# EAGLE design dc_motor (EAGLE 7.2.0)
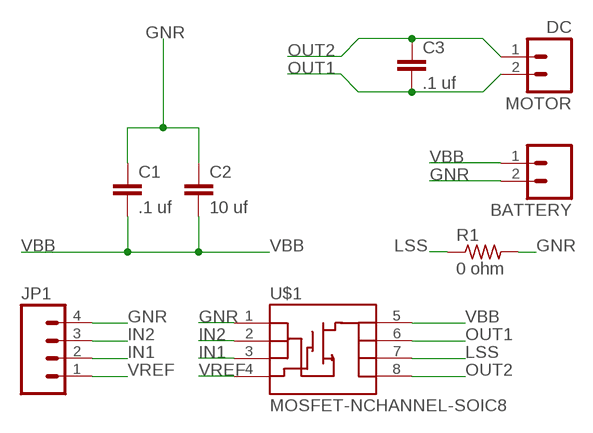
[diagram p0: schematic, sheet 1]

## Parts
BATTERY  M02  [1X02_LONGPADS]
C1  .1 uf  CAP1206  [1206]
C2  10 uf  CAP1206  [1206]
C3  .1 uf  CAP1206  [1206]
JP1  M04LONGPADS  [1X04_LONGPADS]
MOTOR  DC  M02  [1X02_LONGPADS]
R1  0 ohm  RESISTOR1206  [1206]
U$1  MOSFET-NCHANNEL-SOIC8  [SO08]

## Nets
GNR: BATTERY.2 C1.1 C2.1 JP1.4 R1.2 U$1.1(S)
IN1: JP1.2 U$1.3(S)
IN2: JP1.3 U$1.2(S)
LSS: R1.1 U$1.7(D)
OUT1: C3.2 MOTOR.2 U$1.6(D)
OUT2: C3.1 MOTOR.1 U$1.8(D)
VBB: BATTERY.1 C1.2 C2.2 U$1.5(D)
VREF: JP1.1 U$1.4(G)

## Library data of the parts
BATTERY MOTOR = 01_SparkFun:M02: Header 2 Standard 2-pin 0.1" header. Use with straight break away headers (SKU : PRT-00116), right angle break away headers (PRT-00553), swiss pins (PRT-00743), machine pins (PRT-00117), and female headers (PRT-00115). Molex polarized connector foot print use with SKU : PRT-08233 with associated crimp pins and housings.
C1-C3 = 01_SparkFun:CAP: Capacitor Standard 0603 ceramic capacitor, and 0.1" leaded capacitor.
JP1 = 01_SparkFun:M04: Header 4 Standard 4-pin 0.1" header. Use with straight break away headers (SKU : PRT-00116), right angle break away headers (PRT-00553), swiss pins (PRT-00743), machine pins (PRT-00117), and female headers (PRT-00115). Molex polarized connector foot print use with SKU : PRT-08231 with associated crimp pins and housings.
R1 = 01_FAB_Hello:RESISTOR
U$1 = 01_SparkFun:MOSFET-NCHANNEL-SOIC8: N-Channel MOSFET IRF9410 and NDS8434 are common, SOIC-8 parts.

## Board
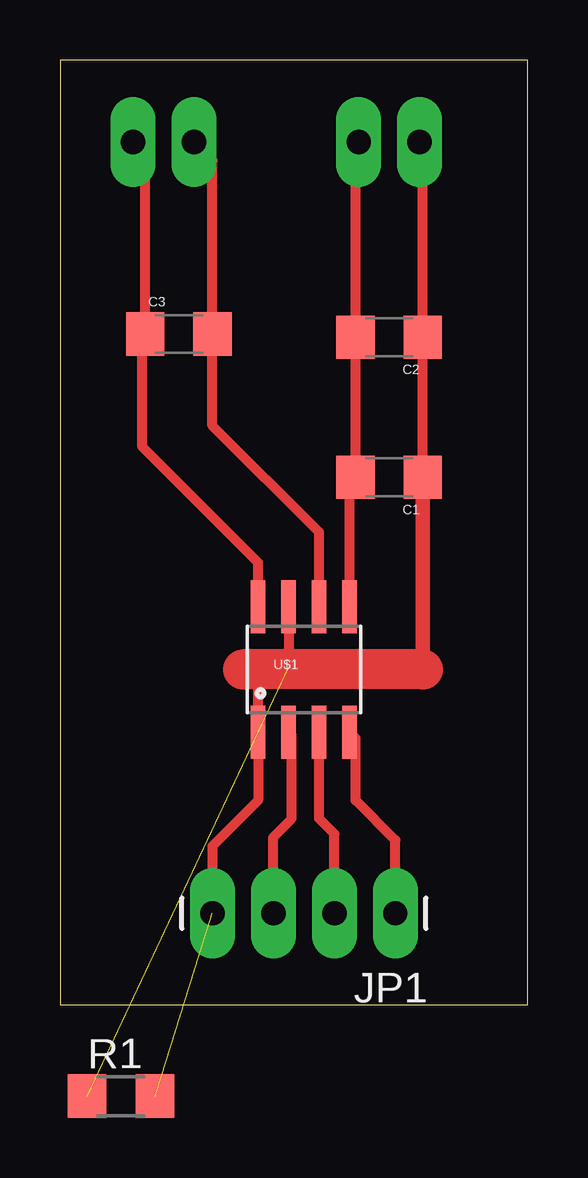
[diagram p1: board, top side]

Size 19.48 x 39.36 mm. Coordinates in mm from the lower left corner, seen from the top.
Outline: 0,0 19.48,0 19.48,39.36 0,39.36 0,0
Copper layers (1*16): Top 0.035mm / dielectric 1.5mm / Bottom 0.035mm
Design rules "default": minimum track width 10mil, minimum drill 24mil, track to track 8mil, track to pad 8mil, pad to pad 8mil, via to via 8mil, smd to smd 8mil, copper to edge 40mil, drill to drill 8mil, minimum pad ring 10mil, minimum via ring 8mil, stop-mask expansion 4mil, vias tented up to drill 0mil, thermal gap 10mil

### Footprints (pad centres in the part's own frame; a part is rotated, then mirrored left to right if it is on the bottom)
1X02_LONGPADS = drill 1.016 pad 1.88 long: 1 0,0; 2 2.54,0
1206 = smd 1.6 x 1.8: 1 -1.4,0; 2 1.4,0
1X04_LONGPADS = drill 1.016 pad 1.88 long: 1 0,0; 2 2.54,0; 3 5.08,0; 4 7.62,0
1206' = smd 1.6 x 1.803: 1 -1.422,0; 2 1.422,0
SO08 = smd 0.61 x 2.21: 1 -1.905,-2.616; 2 -0.635,-2.616; 3 0.635,-2.616; 4 1.905,-2.616; 5 1.905,2.616; 6 0.635,2.616; 7 -0.635,2.616; 8 -1.905,2.616

### Placement (x,y rotation side)
BATTERY  12.45,35.94 0 top
C1  13.72,21.97 180 top
C2  13.72,27.81 180 top
C3  4.95,27.94 0 top
JP1  13.97,3.81 180 top
MOTOR  3.05,35.94 0 top
R1  0 ohm  [1206']  2.54,-3.81 0 top  (outside the outline)
U$1  10.16,13.97 0 top

### Tracks (layer width: path | path; a pad name or v marks a point on that pad's centre or on a via)
GNR  (1 unrouted)
  Top 0.406: C1.1 C2.1 15.12,35.81 BATTERY.2 | JP1.4 6.35,6.6 8.26,8.51 U$1.1 8.26,13.34 7.62,13.97
  Top 0.61: C1.1 15.12,13.97
  Top 1.676: 15.12,13.97 7.62,13.97
IN1
  Top 0.406: JP1.2 11.43,7.11 10.79,7.75 U$1.3
IN2
  Top 0.406: JP1.3 8.89,6.99 9.65,7.75 9.65,11.23 U$1.2
LSS  (1 unrouted)
  Top 0.406: U$1.7 9.53,14.1
OUT1
  Top 0.406: MOTOR.2 6.35,35.18 C3.2 6.35,24.13 10.79,19.68 U$1.6
OUT2
  Top 0.406: MOTOR.1 3.55,35.44 C3.1 3.43,27.82 3.43,23.24 8.26,18.41 U$1.8
VBB
  Top 0.406: BATTERY.1 12.32,35.81 C2.2 C1.2 12.06,21.72 U$1.5
VREF
  Top 0.406: JP1.1 13.97,6.86 12.32,8.51 12.32,11.1 U$1.4